# EAGLE schematic ATtiny84 (EAGLE 8.6.1)
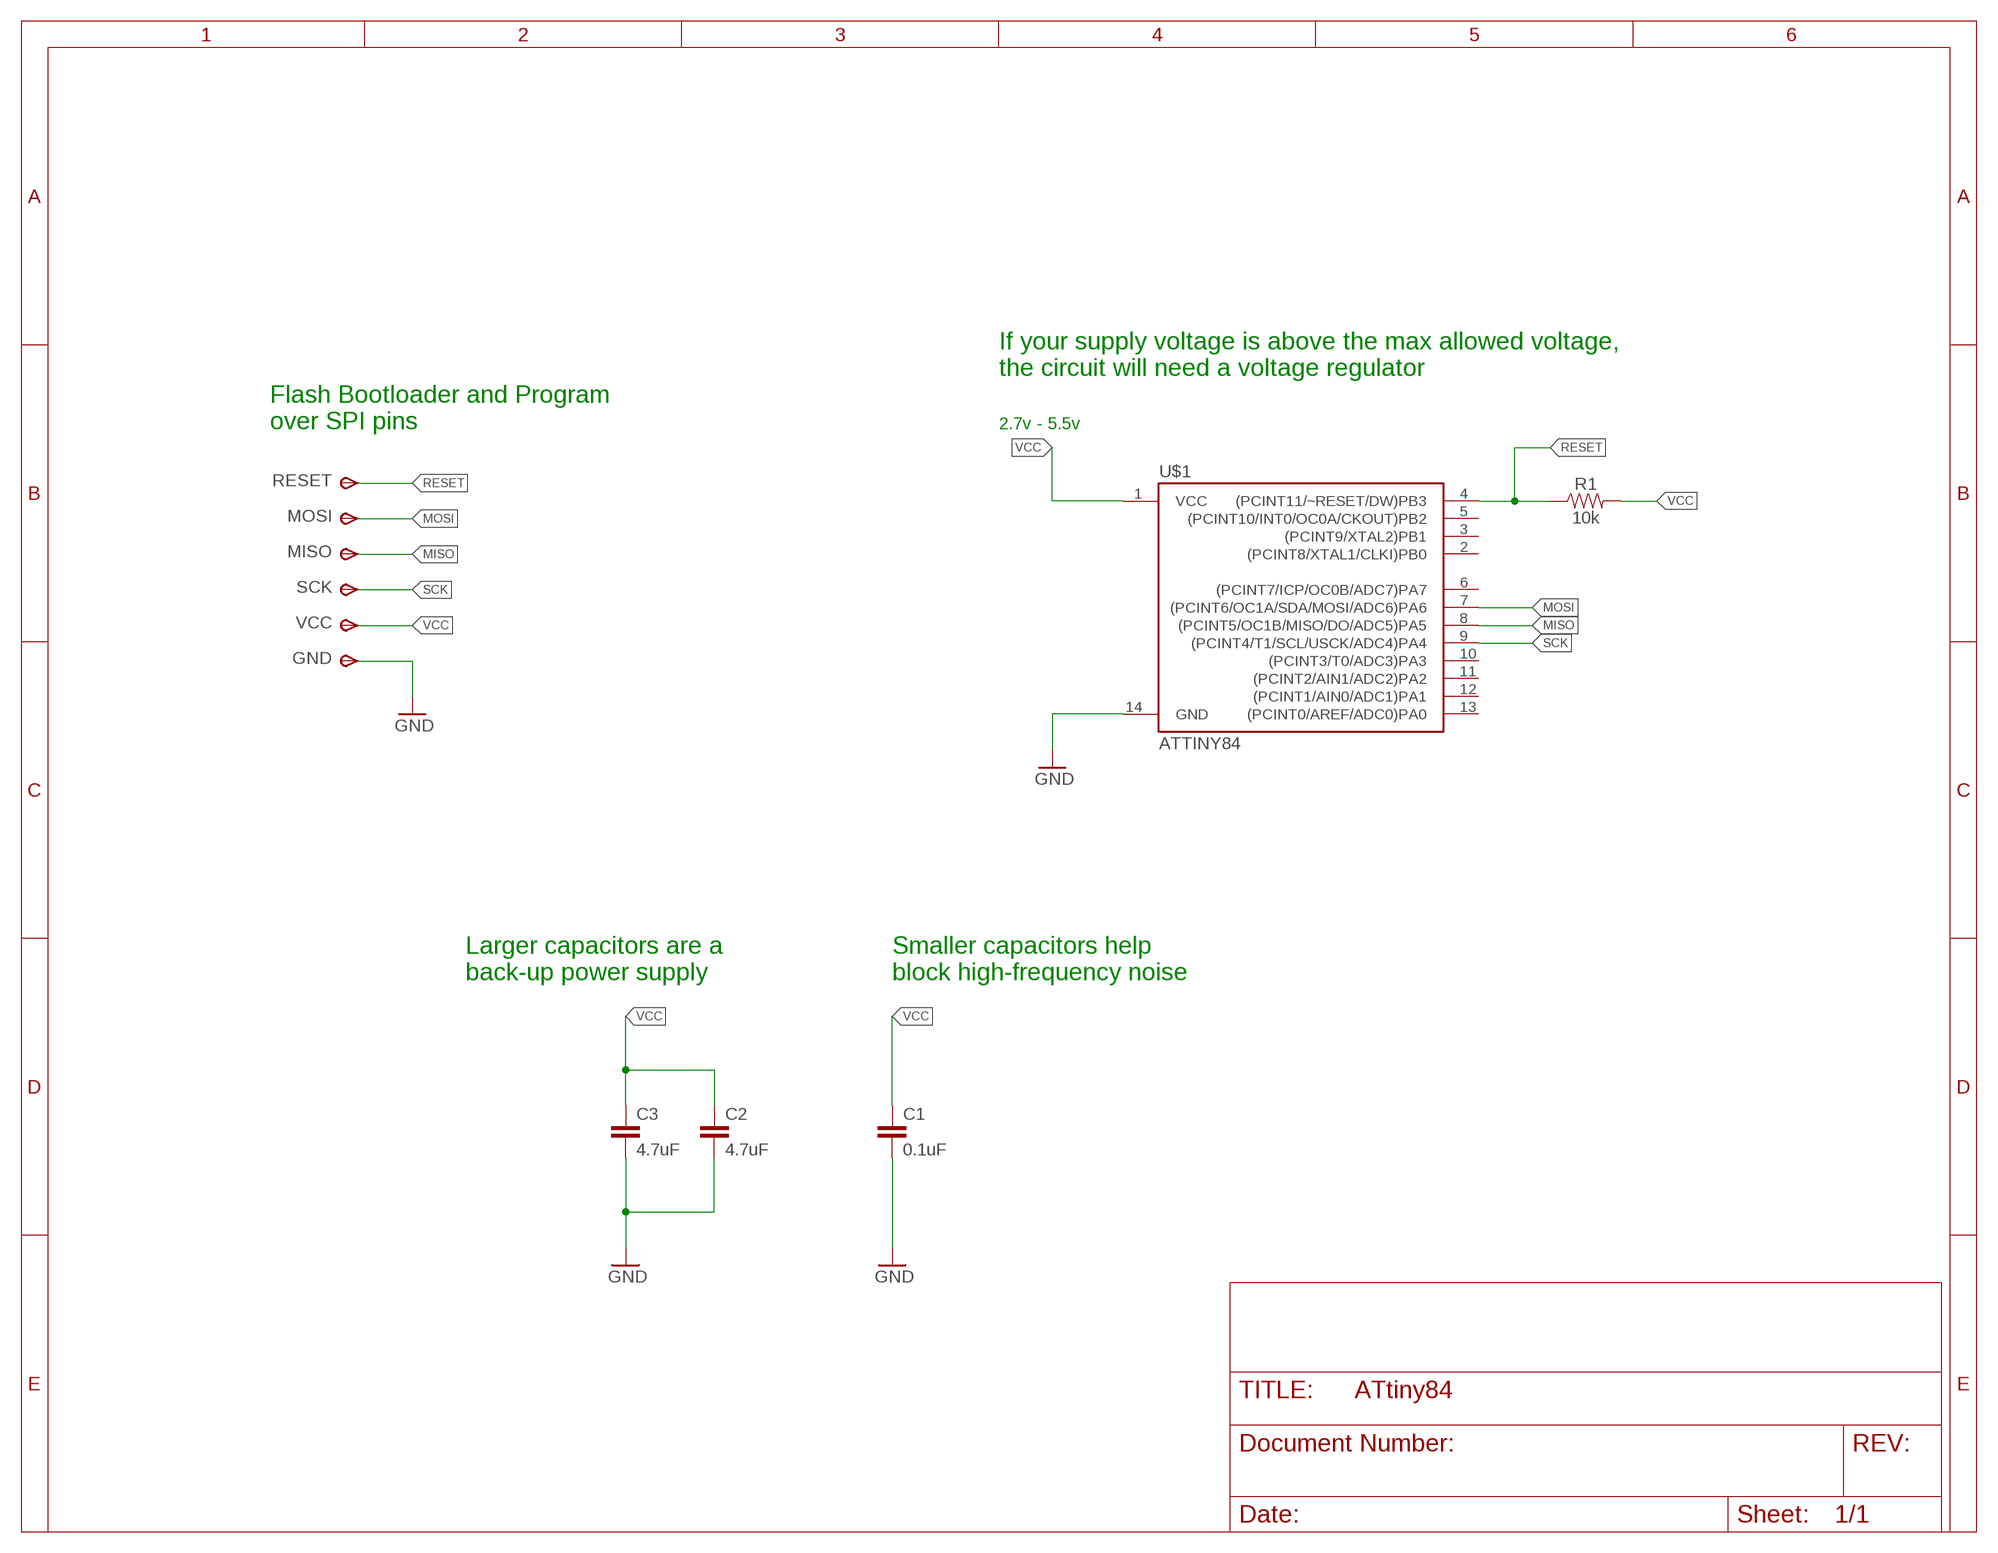
[diagram p0: schematic, sheet 1]

## Parts
C1  0.1uF  0.1UF-0603-25V-5%  [0603]
C2  4.7uF  4.7UF0603  [0603]
C3  4.7uF  4.7UF0603  [0603]
GND  TPSTP14SQ  [TP14SQ]
MISO  TPSTP14SQ  [TP14SQ]
MOSI  TPSTP14SQ  [TP14SQ]
R1  10k  10KOHM-0603-1/10W-1%  [0603]
RESET  TPSTP14SQ  [TP14SQ]
SCK  TPSTP14SQ  [TP14SQ]
U$1  ATTINY84  [SO14]
VCC  TPSTP14SQ  [TP14SQ]

## Nets
GND: C1.2 C2.2 C3.2 GND.TP(PP) U$1.14(GND)
MISO: MISO.TP(PP) U$1.8((PCINT5/OC1B/MISO/DO/ADC5)PA5)
MOSI: MOSI.TP(PP) U$1.7((PCINT6/OC1A/SDA/MOSI/ADC6)PA6)
RESET: R1.1 RESET.TP(PP) U$1.4((PCINT11/~RESET/DW)PB3)
SCK: SCK.TP(PP) U$1.9((PCINT4/T1/SCL/USCK/ADC4)PA4)
VCC: C1.1 C2.1 C3.1 R1.2 U$1.1(VCC) VCC.TP(PP)
Unconnected: U$1.2((PCINT8/XTAL1/CLKI)PB0) U$1.3((PCINT9/XTAL2)PB1) U$1.5((PCINT10/INT0/OC0A/CKOUT)PB2) U$1.6((PCINT7/ICP/OC0B/ADC7)PA7) U$1.10((PCINT3/T0/ADC3)PA3) U$1.11((PCINT2/AIN1/ADC2)PA2) U$1.12((PCINT1/AIN0/ADC1)PA1) U$1.13((PCINT0/AREF/ADC0)PA0)

## Notes on the sheet
- If your supply voltage is above the max allowed voltage,
  the circuit will need a voltage regulator
- Flash Bootloader and Program
  over SPI pins
- 2.7v - 5.5v
- Larger capacitors are a
  back-up power supply
- Smaller capacitors help
  block high-frequency noise

## Library data of the parts
C1 = SparkFun-Capacitors:0.1UF: 0.1µF ceramic capacitors A capacitor is a passive two-terminal electrical component used to store electrical energy temporarily in an electric field.; PROD_ID: CAP-08604
C2 C3 = SparkFun-Capacitors:4.7UF: 4.7µF ceramic capacitors A capacitor is a passive two-terminal electrical component used to store electrical energy temporarily in an electric field.; PROD_ID: CAP-08280
GND MISO MOSI RESET SCK VCC = testpad:TPS: TEST PIN
R1 = SparkFun-Resistors:10KOHM: 10kΩ resistor A resistor is a passive two-terminal electrical component that implements electrical resistance as a circuit element. Resistors act to reduce current flow, and, at the same time, act to lower voltage levels within circuits. - Wikipedia; PROD_ID: RES-00824
U$1 = SparkFun-IC-Microcontroller:ATTINY84: Atmel 14-pin 2/4/8kB flash uC Datasheet <https://cdn.sparkfun.com/datasheets/Widgets/doc8006.pdf> SparkFun Products Tiny AVR Programmer <https://www.sparkfun.com/products/11801> (PGM-11801) SparkFun Servo Trigger - Continuous Rotation <https://www.sparkfun.com/products/13872> (WIG-13872) SparkFun Servo Trigger <https://www.sparkfun.com/products/13118> (WIG-13118); PROD_ID: IC-11285